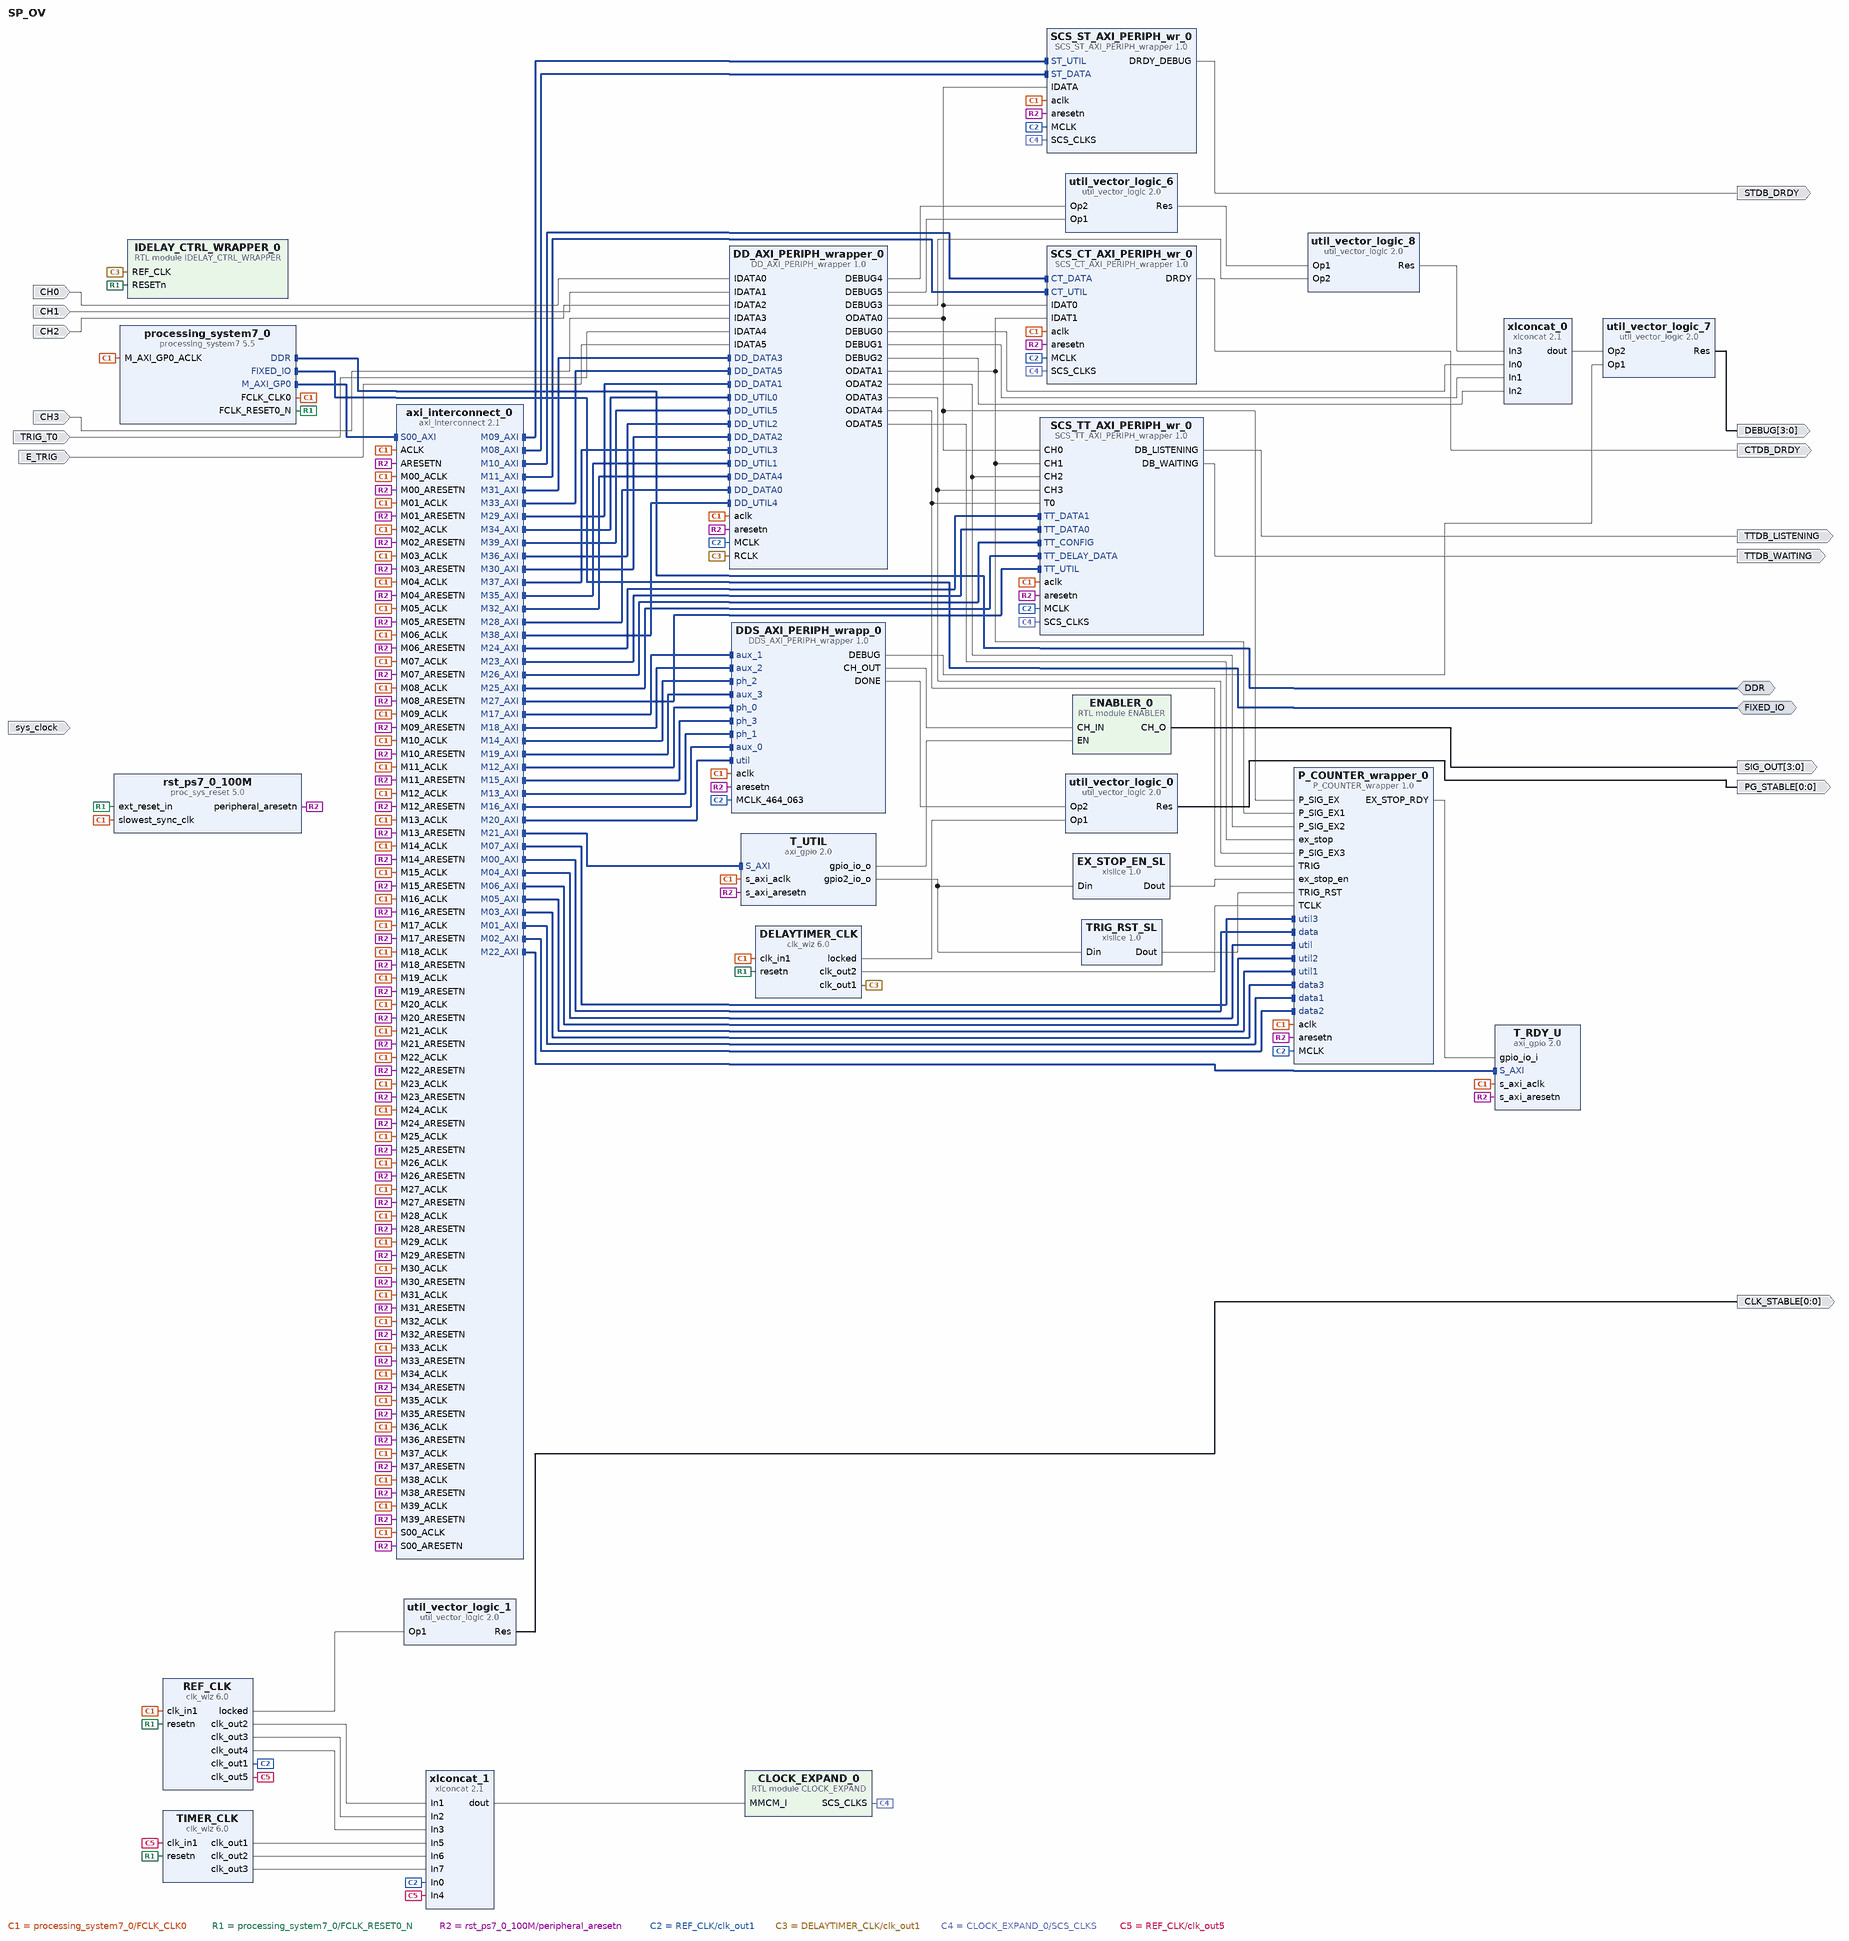
[diagram p0: block diagram of the top level]
# Vivado block design SP_OV, xc7z020clg400-1, Vivado 2019.1
create_bd_design SP_OV

create_bd_intf_port -mode Master -vlnv xilinx.com:interface:ddrx_rtl:1.0 DDR
create_bd_intf_port -mode Master -vlnv xilinx.com:display_processing_system7:fixedio_rtl:1.0 FIXED_IO
create_bd_port -dir I -type clk sys_clock
set_property -dict {CONFIG.FREQ_HZ 125000000 CONFIG.PHASE 0.000} [get_bd_ports sys_clock]
create_bd_port -dir I CH0
create_bd_port -dir I CH1
create_bd_port -dir I CH2
create_bd_port -dir I CH3
create_bd_port -dir O -from 3 -to 0 SIG_OUT
create_bd_port -dir O -from 0 -to 0 PG_STABLE
create_bd_port -dir O -from 0 -to 0 CLK_STABLE
create_bd_port -dir O -from 3 -to 0 DEBUG
create_bd_port -dir I TRIG_T0
create_bd_port -dir I E_TRIG
create_bd_port -dir O STDB_DRDY
create_bd_port -dir O CTDB_DRDY
create_bd_port -dir O TTDB_LISTENING
create_bd_port -dir O TTDB_WAITING

create_bd_cell -type ip -vlnv xilinx.com:ip:processing_system7:5.5 processing_system7_0
set_property -dict [list \
  CONFIG.PCW_APU_PERIPHERAL_FREQMHZ 650 \
  CONFIG.PCW_CRYSTAL_PERIPHERAL_FREQMHZ 50 \
  CONFIG.PCW_ENET0_ENET0_IO {MIO 16 .. 27} \
  CONFIG.PCW_ENET0_GRP_MDIO_ENABLE 1 \
  CONFIG.PCW_ENET0_GRP_MDIO_IO {MIO 52 .. 53} \
  CONFIG.PCW_ENET0_PERIPHERAL_ENABLE 1 \
  CONFIG.PCW_ENET0_RESET_ENABLE 1 \
  CONFIG.PCW_ENET0_RESET_IO {MIO 9} \
  CONFIG.PCW_ENET_RESET_ENABLE 1 \
  CONFIG.PCW_ENET_RESET_SELECT {Share reset pin} \
  CONFIG.PCW_FPGA0_PERIPHERAL_FREQMHZ 100 \
  CONFIG.PCW_FPGA1_PERIPHERAL_FREQMHZ 50 \
  CONFIG.PCW_GPIO_MIO_GPIO_ENABLE 1 \
  CONFIG.PCW_GPIO_MIO_GPIO_IO MIO \
  CONFIG.PCW_I2C_RESET_ENABLE 1 \
  CONFIG.PCW_M_AXI_GP0_FREQMHZ 10 \
  CONFIG.PCW_PERIPHERAL_BOARD_PRESET part0 \
  CONFIG.PCW_PRESET_BANK1_VOLTAGE {LVCMOS 1.8V} \
  CONFIG.PCW_QSPI_GRP_FBCLK_ENABLE 1 \
  CONFIG.PCW_QSPI_GRP_FBCLK_IO {MIO 8} \
  CONFIG.PCW_QSPI_GRP_SINGLE_SS_ENABLE 1 \
  CONFIG.PCW_QSPI_GRP_SINGLE_SS_IO {MIO 1 .. 6} \
  CONFIG.PCW_QSPI_PERIPHERAL_ENABLE 1 \
  CONFIG.PCW_QSPI_QSPI_IO {MIO 1 .. 6} \
  CONFIG.PCW_SD0_GRP_CD_ENABLE 1 \
  CONFIG.PCW_SD0_GRP_CD_IO {MIO 47} \
  CONFIG.PCW_SD0_GRP_WP_ENABLE 0 \
  CONFIG.PCW_SD0_PERIPHERAL_ENABLE 1 \
  CONFIG.PCW_SD0_SD0_IO {MIO 40 .. 45} \
  CONFIG.PCW_SDIO_PERIPHERAL_FREQMHZ 50 \
  CONFIG.PCW_SINGLE_QSPI_DATA_MODE x4 \
  CONFIG.PCW_UART0_PERIPHERAL_ENABLE 1 \
  CONFIG.PCW_UART0_UART0_IO {MIO 14 .. 15} \
  CONFIG.PCW_UART1_PERIPHERAL_ENABLE 0 \
  CONFIG.PCW_UART_PERIPHERAL_FREQMHZ 100 \
  CONFIG.PCW_UIPARAM_DDR_BUS_WIDTH {16 Bit} \
  CONFIG.PCW_UIPARAM_DDR_FREQ_MHZ 525 \
  CONFIG.PCW_UIPARAM_DDR_PARTNO {MT41J256M16 RE-125} \
  CONFIG.PCW_USB0_PERIPHERAL_ENABLE 1 \
  CONFIG.PCW_USB0_RESET_ENABLE 1 \
  CONFIG.PCW_USB0_RESET_IO {MIO 46} \
  CONFIG.PCW_USB0_USB0_IO {MIO 28 .. 39} \
  CONFIG.PCW_USB_RESET_ENABLE 1 \
  CONFIG.PCW_USB_RESET_SELECT {Share reset pin} \
] [get_bd_cells processing_system7_0]
# 486 more settings of processing_system7_0 are not shown: defaults, MIO pin electricals, DDR timing, and values the tool derives
create_bd_cell -type ip -vlnv xilinx.com:ip:axi_interconnect:2.1 axi_interconnect_0
set_property -dict {CONFIG.NUM_MI 40} [get_bd_cells axi_interconnect_0]
create_bd_cell -type ip -vlnv xilinx.com:ip:proc_sys_reset:5.0 rst_ps7_0_100M
create_bd_cell -type ip -vlnv xilinx.com:ip:util_vector_logic:2.0 util_vector_logic_0
set_property -dict {CONFIG.C_SIZE 1} [get_bd_cells util_vector_logic_0]
create_bd_cell -type ip -vlnv xilinx.com:ip:util_vector_logic:2.0 util_vector_logic_1
set_property -dict {CONFIG.C_SIZE 1} [get_bd_cells util_vector_logic_1]
create_bd_cell -type module -reference ENABLER ENABLER_0
create_bd_cell -type ip -vlnv xilinx.com:ip:axi_gpio:2.0 T_UTIL
set_property -dict [list \
  CONFIG.C_ALL_OUTPUTS 1 \
  CONFIG.C_ALL_OUTPUTS_2 1 \
  CONFIG.C_DOUT_DEFAULT 0x0000000F \
  CONFIG.C_GPIO2_WIDTH 2 \
  CONFIG.C_GPIO_WIDTH 4 \
  CONFIG.C_IS_DUAL 1 \
] [get_bd_cells T_UTIL]
create_bd_cell -type ip -vlnv xilinx.com:ip:xlslice:1.0 TRIG_RST_SL
set_property -dict {CONFIG.DIN_FROM 0 CONFIG.DIN_TO 0 CONFIG.DIN_WIDTH 2} [get_bd_cells TRIG_RST_SL]
create_bd_cell -type ip -vlnv xilinx.com:ip:xlslice:1.0 EX_STOP_EN_SL
set_property -dict {CONFIG.DIN_FROM 1 CONFIG.DIN_TO 1 CONFIG.DIN_WIDTH 2} [get_bd_cells EX_STOP_EN_SL]
create_bd_cell -type ip -vlnv xilinx.com:ip:axi_gpio:2.0 T_RDY_U
set_property -dict {CONFIG.C_ALL_INPUTS 1 CONFIG.C_GPIO_WIDTH 1} [get_bd_cells T_RDY_U]
create_bd_cell -type ip -vlnv cri.nz:user:P_COUNTER_wrapper:1.0 P_COUNTER_wrapper_0
create_bd_cell -type ip -vlnv cri.nz:user:DDS_AXI_PERIPH_wrapper:1.0 DDS_AXI_PERIPH_wrapp_0
create_bd_cell -type ip -vlnv cri.nz:user:DD_AXI_PERIPH_wrapper:1.0 DD_AXI_PERIPH_wrapper_0
create_bd_cell -type ip -vlnv xilinx.com:ip:clk_wiz:6.0 DELAYTIMER_CLK
set_property -dict [list \
  CONFIG.CLKOUT1_JITTER 204.659 \
  CONFIG.CLKOUT1_PHASE_ERROR 297.890 \
  CONFIG.CLKOUT1_REQUESTED_OUT_FREQ 310.000 \
  CONFIG.CLKOUT2_JITTER 232.152 \
  CONFIG.CLKOUT2_PHASE_ERROR 297.890 \
  CONFIG.CLKOUT2_REQUESTED_OUT_FREQ 125.000 \
  CONFIG.CLKOUT2_USED true \
  CONFIG.MMCM_CLKFBOUT_MULT_F 50.375 \
  CONFIG.MMCM_CLKOUT0_DIVIDE_F 3.250 \
  CONFIG.MMCM_CLKOUT1_DIVIDE 8 \
  CONFIG.MMCM_DIVCLK_DIVIDE 5 \
  CONFIG.NUM_OUT_CLKS 2 \
  CONFIG.PRIM_IN_FREQ 100.000 \
  CONFIG.RESET_PORT resetn \
  CONFIG.RESET_TYPE ACTIVE_LOW \
  CONFIG.USE_LOCKED true \
] [get_bd_cells DELAYTIMER_CLK]
create_bd_cell -type module -reference IDELAY_CTRL_WRAPPER IDELAY_CTRL_WRAPPER_0
create_bd_cell -type ip -vlnv xilinx.com:ip:clk_wiz:6.0 REF_CLK
set_property -dict [list \
  CONFIG.CLKOUT1_JITTER 210.749 \
  CONFIG.CLKOUT1_PHASE_ERROR 303.235 \
  CONFIG.CLKOUT1_REQUESTED_OUT_FREQ 460.000 \
  CONFIG.CLKOUT2_JITTER 210.749 \
  CONFIG.CLKOUT2_PHASE_ERROR 303.235 \
  CONFIG.CLKOUT2_REQUESTED_OUT_FREQ 460.000 \
  CONFIG.CLKOUT2_REQUESTED_PHASE 22.5 \
  CONFIG.CLKOUT2_USED true \
  CONFIG.CLKOUT3_JITTER 210.749 \
  CONFIG.CLKOUT3_PHASE_ERROR 303.235 \
  CONFIG.CLKOUT3_REQUESTED_OUT_FREQ 460.000 \
  CONFIG.CLKOUT3_REQUESTED_PHASE 45 \
  CONFIG.CLKOUT3_USED true \
  CONFIG.CLKOUT4_JITTER 210.749 \
  CONFIG.CLKOUT4_PHASE_ERROR 303.235 \
  CONFIG.CLKOUT4_REQUESTED_OUT_FREQ 460.000 \
  CONFIG.CLKOUT4_REQUESTED_PHASE 67.5 \
  CONFIG.CLKOUT4_USED true \
  CONFIG.CLKOUT5_JITTER 210.749 \
  CONFIG.CLKOUT5_PHASE_ERROR 303.235 \
  CONFIG.CLKOUT5_REQUESTED_OUT_FREQ 460 \
  CONFIG.CLKOUT5_REQUESTED_PHASE 90 \
  CONFIG.CLKOUT5_USED true \
  CONFIG.MMCM_CLKFBOUT_MULT_F 46.000 \
  CONFIG.MMCM_CLKOUT0_DIVIDE_F 2.000 \
  CONFIG.MMCM_CLKOUT1_DIVIDE 2 \
  CONFIG.MMCM_CLKOUT1_PHASE 22.500 \
  CONFIG.MMCM_CLKOUT2_DIVIDE 2 \
  CONFIG.MMCM_CLKOUT2_PHASE 45.000 \
  CONFIG.MMCM_CLKOUT3_DIVIDE 2 \
  CONFIG.MMCM_CLKOUT3_PHASE 67.500 \
  CONFIG.MMCM_CLKOUT4_DIVIDE 2 \
  CONFIG.MMCM_CLKOUT4_PHASE 90.000 \
  CONFIG.MMCM_DIVCLK_DIVIDE 5 \
  CONFIG.NUM_OUT_CLKS 5 \
  CONFIG.RESET_PORT resetn \
  CONFIG.RESET_TYPE ACTIVE_LOW \
  CONFIG.USE_LOCKED true \
] [get_bd_cells REF_CLK]
create_bd_cell -type ip -vlnv xilinx.com:ip:clk_wiz:6.0 TIMER_CLK
set_property -dict [list \
  CONFIG.CLKIN1_JITTER_PS 21.74 \
  CONFIG.CLKOUT1_JITTER 81.270 \
  CONFIG.CLKOUT1_PHASE_ERROR 90.087 \
  CONFIG.CLKOUT1_REQUESTED_OUT_FREQ 460.000 \
  CONFIG.CLKOUT1_REQUESTED_PHASE 22.5 \
  CONFIG.CLKOUT2_JITTER 81.270 \
  CONFIG.CLKOUT2_PHASE_ERROR 90.087 \
  CONFIG.CLKOUT2_REQUESTED_OUT_FREQ 460.000 \
  CONFIG.CLKOUT2_REQUESTED_PHASE 45 \
  CONFIG.CLKOUT2_USED true \
  CONFIG.CLKOUT3_JITTER 81.270 \
  CONFIG.CLKOUT3_PHASE_ERROR 90.087 \
  CONFIG.CLKOUT3_REQUESTED_OUT_FREQ 460.000 \
  CONFIG.CLKOUT3_REQUESTED_PHASE 67.5 \
  CONFIG.CLKOUT3_USED true \
  CONFIG.CLKOUT4_JITTER 81.270 \
  CONFIG.CLKOUT4_PHASE_ERROR 90.087 \
  CONFIG.CLKOUT4_REQUESTED_OUT_FREQ 460.000 \
  CONFIG.CLKOUT4_REQUESTED_PHASE 90 \
  CONFIG.CLKOUT4_USED false \
  CONFIG.JITTER_SEL Min_O_Jitter \
  CONFIG.MMCM_BANDWIDTH HIGH \
  CONFIG.MMCM_CLKFBOUT_MULT_F 4.000 \
  CONFIG.MMCM_CLKIN1_PERIOD 2.174 \
  CONFIG.MMCM_CLKIN2_PERIOD 10.0 \
  CONFIG.MMCM_CLKOUT0_DIVIDE_F 2.000 \
  CONFIG.MMCM_CLKOUT0_PHASE 22.500 \
  CONFIG.MMCM_CLKOUT1_DIVIDE 2 \
  CONFIG.MMCM_CLKOUT1_PHASE 45.000 \
  CONFIG.MMCM_CLKOUT2_DIVIDE 2 \
  CONFIG.MMCM_CLKOUT2_PHASE 67.500 \
  CONFIG.MMCM_CLKOUT3_DIVIDE 1 \
  CONFIG.MMCM_CLKOUT3_PHASE 90.000 \
  CONFIG.MMCM_DIVCLK_DIVIDE 2 \
  CONFIG.NUM_OUT_CLKS 3 \
  CONFIG.PRIM_IN_FREQ 460 \
  CONFIG.RESET_PORT resetn \
  CONFIG.RESET_TYPE ACTIVE_LOW \
  CONFIG.USE_LOCKED false \
] [get_bd_cells TIMER_CLK]
create_bd_cell -type ip -vlnv xilinx.com:ip:util_vector_logic:2.0 util_vector_logic_6
set_property -dict {CONFIG.C_SIZE 1} [get_bd_cells util_vector_logic_6]
create_bd_cell -type ip -vlnv xilinx.com:ip:util_vector_logic:2.0 util_vector_logic_7
set_property -dict {CONFIG.C_OPERATION and CONFIG.C_SIZE 4} [get_bd_cells util_vector_logic_7]
create_bd_cell -type ip -vlnv xilinx.com:ip:xlconcat:2.1 xlconcat_0
set_property -dict {CONFIG.NUM_PORTS 4} [get_bd_cells xlconcat_0]
create_bd_cell -type ip -vlnv xilinx.com:ip:util_vector_logic:2.0 util_vector_logic_8
set_property -dict {CONFIG.C_SIZE 1} [get_bd_cells util_vector_logic_8]
create_bd_cell -type module -reference CLOCK_EXPAND CLOCK_EXPAND_0
create_bd_cell -type ip -vlnv xilinx.com:ip:xlconcat:2.1 xlconcat_1
set_property -dict {CONFIG.NUM_PORTS 8} [get_bd_cells xlconcat_1]
create_bd_cell -type ip -vlnv cri.nz:user:SCS_CT_AXI_PERIPH_wrapper:1.0 SCS_CT_AXI_PERIPH_wr_0
create_bd_cell -type ip -vlnv cri.nz:user:SCS_ST_AXI_PERIPH_wrapper:1.0 SCS_ST_AXI_PERIPH_wr_0
create_bd_cell -type ip -vlnv cri.nz:user:SCS_TT_AXI_PERIPH_wrapper:1.0 SCS_TT_AXI_PERIPH_wr_0

# ---- connections ----

connect_bd_intf_net [get_bd_intf_pins DD_AXI_PERIPH_wrapper_0/DD_DATA3] [get_bd_intf_pins axi_interconnect_0/M31_AXI]
connect_bd_intf_net [get_bd_intf_pins DD_AXI_PERIPH_wrapper_0/DD_DATA5] [get_bd_intf_pins axi_interconnect_0/M33_AXI]
connect_bd_intf_net [get_bd_intf_pins axi_interconnect_0/M10_AXI] [get_bd_intf_pins SCS_CT_AXI_PERIPH_wr_0/CT_DATA]
connect_bd_intf_net [get_bd_intf_pins axi_interconnect_0/M11_AXI] [get_bd_intf_pins SCS_CT_AXI_PERIPH_wr_0/CT_UTIL]
connect_bd_intf_net [get_bd_intf_pins axi_interconnect_0/M09_AXI] [get_bd_intf_pins SCS_ST_AXI_PERIPH_wr_0/ST_UTIL]
connect_bd_intf_net [get_bd_intf_pins axi_interconnect_0/M08_AXI] [get_bd_intf_pins SCS_ST_AXI_PERIPH_wr_0/ST_DATA]
connect_bd_intf_net [get_bd_intf_pins DD_AXI_PERIPH_wrapper_0/DD_DATA1] [get_bd_intf_pins axi_interconnect_0/M29_AXI]
connect_bd_intf_net [get_bd_intf_pins DD_AXI_PERIPH_wrapper_0/DD_UTIL0] [get_bd_intf_pins axi_interconnect_0/M34_AXI]
connect_bd_intf_net [get_bd_intf_pins axi_interconnect_0/M22_AXI] [get_bd_intf_pins T_RDY_U/S_AXI]
connect_bd_intf_net [get_bd_intf_pins P_COUNTER_wrapper_0/util3] [get_bd_intf_pins axi_interconnect_0/M07_AXI]
connect_bd_intf_net [get_bd_intf_pins P_COUNTER_wrapper_0/data] [get_bd_intf_pins axi_interconnect_0/M00_AXI]
connect_bd_intf_net [get_bd_intf_pins P_COUNTER_wrapper_0/util] [get_bd_intf_pins axi_interconnect_0/M04_AXI]
connect_bd_intf_net [get_bd_intf_ports DDR] [get_bd_intf_pins processing_system7_0/DDR]
connect_bd_intf_net [get_bd_intf_pins axi_interconnect_0/M17_AXI] [get_bd_intf_pins DDS_AXI_PERIPH_wrapp_0/aux_1]
connect_bd_intf_net [get_bd_intf_ports FIXED_IO] [get_bd_intf_pins processing_system7_0/FIXED_IO]
connect_bd_intf_net [get_bd_intf_pins P_COUNTER_wrapper_0/util2] [get_bd_intf_pins axi_interconnect_0/M06_AXI]
connect_bd_intf_net [get_bd_intf_pins axi_interconnect_0/M18_AXI] [get_bd_intf_pins DDS_AXI_PERIPH_wrapp_0/aux_2]
connect_bd_intf_net [get_bd_intf_pins P_COUNTER_wrapper_0/util1] [get_bd_intf_pins axi_interconnect_0/M05_AXI]
connect_bd_intf_net [get_bd_intf_pins processing_system7_0/M_AXI_GP0] [get_bd_intf_pins axi_interconnect_0/S00_AXI]
connect_bd_intf_net [get_bd_intf_pins axi_interconnect_0/M14_AXI] [get_bd_intf_pins DDS_AXI_PERIPH_wrapp_0/ph_2]
connect_bd_intf_net [get_bd_intf_pins axi_interconnect_0/M19_AXI] [get_bd_intf_pins DDS_AXI_PERIPH_wrapp_0/aux_3]
connect_bd_intf_net [get_bd_intf_pins axi_interconnect_0/M12_AXI] [get_bd_intf_pins DDS_AXI_PERIPH_wrapp_0/ph_0]
connect_bd_intf_net [get_bd_intf_pins P_COUNTER_wrapper_0/data3] [get_bd_intf_pins axi_interconnect_0/M03_AXI]
connect_bd_intf_net [get_bd_intf_pins axi_interconnect_0/M15_AXI] [get_bd_intf_pins DDS_AXI_PERIPH_wrapp_0/ph_3]
connect_bd_intf_net [get_bd_intf_pins P_COUNTER_wrapper_0/data1] [get_bd_intf_pins axi_interconnect_0/M01_AXI]
connect_bd_intf_net [get_bd_intf_pins axi_interconnect_0/M21_AXI] [get_bd_intf_pins T_UTIL/S_AXI]
connect_bd_intf_net [get_bd_intf_pins axi_interconnect_0/M13_AXI] [get_bd_intf_pins DDS_AXI_PERIPH_wrapp_0/ph_1]
connect_bd_intf_net [get_bd_intf_pins axi_interconnect_0/M16_AXI] [get_bd_intf_pins DDS_AXI_PERIPH_wrapp_0/aux_0]
connect_bd_intf_net [get_bd_intf_pins P_COUNTER_wrapper_0/data2] [get_bd_intf_pins axi_interconnect_0/M02_AXI]
connect_bd_intf_net [get_bd_intf_pins axi_interconnect_0/M20_AXI] [get_bd_intf_pins DDS_AXI_PERIPH_wrapp_0/util]
connect_bd_intf_net [get_bd_intf_pins SCS_TT_AXI_PERIPH_wr_0/TT_DATA1] [get_bd_intf_pins axi_interconnect_0/M24_AXI]
connect_bd_intf_net [get_bd_intf_pins SCS_TT_AXI_PERIPH_wr_0/TT_DATA0] [get_bd_intf_pins axi_interconnect_0/M23_AXI]
connect_bd_intf_net [get_bd_intf_pins DD_AXI_PERIPH_wrapper_0/DD_UTIL5] [get_bd_intf_pins axi_interconnect_0/M39_AXI]
connect_bd_intf_net [get_bd_intf_pins DD_AXI_PERIPH_wrapper_0/DD_UTIL2] [get_bd_intf_pins axi_interconnect_0/M36_AXI]
connect_bd_intf_net [get_bd_intf_pins DD_AXI_PERIPH_wrapper_0/DD_DATA2] [get_bd_intf_pins axi_interconnect_0/M30_AXI]
connect_bd_intf_net [get_bd_intf_pins DD_AXI_PERIPH_wrapper_0/DD_UTIL3] [get_bd_intf_pins axi_interconnect_0/M37_AXI]
connect_bd_intf_net [get_bd_intf_pins DD_AXI_PERIPH_wrapper_0/DD_UTIL1] [get_bd_intf_pins axi_interconnect_0/M35_AXI]
connect_bd_intf_net [get_bd_intf_pins SCS_TT_AXI_PERIPH_wr_0/TT_CONFIG] [get_bd_intf_pins axi_interconnect_0/M26_AXI]
connect_bd_intf_net [get_bd_intf_pins SCS_TT_AXI_PERIPH_wr_0/TT_DELAY_DATA] [get_bd_intf_pins axi_interconnect_0/M25_AXI]
connect_bd_intf_net [get_bd_intf_pins SCS_TT_AXI_PERIPH_wr_0/TT_UTIL] [get_bd_intf_pins axi_interconnect_0/M27_AXI]
connect_bd_intf_net [get_bd_intf_pins DD_AXI_PERIPH_wrapper_0/DD_DATA4] [get_bd_intf_pins axi_interconnect_0/M32_AXI]
connect_bd_intf_net [get_bd_intf_pins DD_AXI_PERIPH_wrapper_0/DD_DATA0] [get_bd_intf_pins axi_interconnect_0/M28_AXI]
connect_bd_intf_net [get_bd_intf_pins DD_AXI_PERIPH_wrapper_0/DD_UTIL4] [get_bd_intf_pins axi_interconnect_0/M38_AXI]
connect_bd_net [get_bd_pins processing_system7_0/FCLK_CLK0] \
  [get_bd_pins axi_interconnect_0/ACLK] [get_bd_pins rst_ps7_0_100M/slowest_sync_clk] \
  [get_bd_pins processing_system7_0/M_AXI_GP0_ACLK] [get_bd_pins axi_interconnect_0/S00_ACLK] \
  [get_bd_pins axi_interconnect_0/M00_ACLK] [get_bd_pins axi_interconnect_0/M01_ACLK] \
  [get_bd_pins axi_interconnect_0/M02_ACLK] [get_bd_pins axi_interconnect_0/M03_ACLK] \
  [get_bd_pins axi_interconnect_0/M04_ACLK] [get_bd_pins axi_interconnect_0/M05_ACLK] \
  [get_bd_pins axi_interconnect_0/M06_ACLK] [get_bd_pins axi_interconnect_0/M07_ACLK] \
  [get_bd_pins axi_interconnect_0/M12_ACLK] [get_bd_pins axi_interconnect_0/M13_ACLK] \
  [get_bd_pins axi_interconnect_0/M14_ACLK] [get_bd_pins axi_interconnect_0/M15_ACLK] \
  [get_bd_pins axi_interconnect_0/M16_ACLK] [get_bd_pins axi_interconnect_0/M17_ACLK] \
  [get_bd_pins axi_interconnect_0/M18_ACLK] [get_bd_pins axi_interconnect_0/M08_ACLK] \
  [get_bd_pins axi_interconnect_0/M09_ACLK] [get_bd_pins axi_interconnect_0/M10_ACLK] \
  [get_bd_pins axi_interconnect_0/M11_ACLK] [get_bd_pins axi_interconnect_0/M19_ACLK] \
  [get_bd_pins axi_interconnect_0/M20_ACLK] [get_bd_pins T_UTIL/s_axi_aclk] [get_bd_pins axi_interconnect_0/M21_ACLK] \
  [get_bd_pins T_RDY_U/s_axi_aclk] [get_bd_pins axi_interconnect_0/M22_ACLK] [get_bd_pins P_COUNTER_wrapper_0/aclk] \
  [get_bd_pins DDS_AXI_PERIPH_wrapp_0/aclk] [get_bd_pins axi_interconnect_0/M23_ACLK] \
  [get_bd_pins axi_interconnect_0/M24_ACLK] [get_bd_pins axi_interconnect_0/M25_ACLK] \
  [get_bd_pins axi_interconnect_0/M26_ACLK] [get_bd_pins axi_interconnect_0/M27_ACLK] \
  [get_bd_pins axi_interconnect_0/M28_ACLK] [get_bd_pins DD_AXI_PERIPH_wrapper_0/aclk] [get_bd_pins DELAYTIMER_CLK/clk_in1] \
  [get_bd_pins axi_interconnect_0/M29_ACLK] [get_bd_pins axi_interconnect_0/M30_ACLK] \
  [get_bd_pins axi_interconnect_0/M31_ACLK] [get_bd_pins axi_interconnect_0/M32_ACLK] \
  [get_bd_pins axi_interconnect_0/M33_ACLK] [get_bd_pins axi_interconnect_0/M34_ACLK] \
  [get_bd_pins axi_interconnect_0/M35_ACLK] [get_bd_pins axi_interconnect_0/M36_ACLK] \
  [get_bd_pins axi_interconnect_0/M37_ACLK] [get_bd_pins axi_interconnect_0/M38_ACLK] \
  [get_bd_pins axi_interconnect_0/M39_ACLK] [get_bd_pins REF_CLK/clk_in1] [get_bd_pins SCS_CT_AXI_PERIPH_wr_0/aclk] \
  [get_bd_pins SCS_ST_AXI_PERIPH_wr_0/aclk] [get_bd_pins SCS_TT_AXI_PERIPH_wr_0/aclk]
connect_bd_net [get_bd_pins processing_system7_0/FCLK_RESET0_N] \
  [get_bd_pins rst_ps7_0_100M/ext_reset_in] [get_bd_pins DELAYTIMER_CLK/resetn] [get_bd_pins IDELAY_CTRL_WRAPPER_0/RESETn] \
  [get_bd_pins REF_CLK/resetn] [get_bd_pins TIMER_CLK/resetn]
connect_bd_net [get_bd_pins rst_ps7_0_100M/peripheral_aresetn] \
  [get_bd_pins axi_interconnect_0/ARESETN] [get_bd_pins axi_interconnect_0/S00_ARESETN] \
  [get_bd_pins axi_interconnect_0/M00_ARESETN] [get_bd_pins axi_interconnect_0/M01_ARESETN] \
  [get_bd_pins axi_interconnect_0/M02_ARESETN] [get_bd_pins axi_interconnect_0/M03_ARESETN] \
  [get_bd_pins axi_interconnect_0/M04_ARESETN] [get_bd_pins axi_interconnect_0/M05_ARESETN] \
  [get_bd_pins axi_interconnect_0/M06_ARESETN] [get_bd_pins axi_interconnect_0/M07_ARESETN] \
  [get_bd_pins axi_interconnect_0/M12_ARESETN] [get_bd_pins axi_interconnect_0/M13_ARESETN] \
  [get_bd_pins axi_interconnect_0/M14_ARESETN] [get_bd_pins axi_interconnect_0/M15_ARESETN] \
  [get_bd_pins axi_interconnect_0/M16_ARESETN] [get_bd_pins axi_interconnect_0/M17_ARESETN] \
  [get_bd_pins axi_interconnect_0/M18_ARESETN] [get_bd_pins axi_interconnect_0/M08_ARESETN] \
  [get_bd_pins axi_interconnect_0/M09_ARESETN] [get_bd_pins axi_interconnect_0/M10_ARESETN] \
  [get_bd_pins axi_interconnect_0/M11_ARESETN] [get_bd_pins axi_interconnect_0/M19_ARESETN] \
  [get_bd_pins axi_interconnect_0/M20_ARESETN] [get_bd_pins T_UTIL/s_axi_aresetn] \
  [get_bd_pins axi_interconnect_0/M21_ARESETN] [get_bd_pins T_RDY_U/s_axi_aresetn] \
  [get_bd_pins axi_interconnect_0/M22_ARESETN] [get_bd_pins P_COUNTER_wrapper_0/aresetn] \
  [get_bd_pins DDS_AXI_PERIPH_wrapp_0/aresetn] [get_bd_pins axi_interconnect_0/M23_ARESETN] \
  [get_bd_pins axi_interconnect_0/M24_ARESETN] [get_bd_pins axi_interconnect_0/M25_ARESETN] \
  [get_bd_pins axi_interconnect_0/M26_ARESETN] [get_bd_pins axi_interconnect_0/M27_ARESETN] \
  [get_bd_pins axi_interconnect_0/M28_ARESETN] [get_bd_pins DD_AXI_PERIPH_wrapper_0/aresetn] \
  [get_bd_pins axi_interconnect_0/M29_ARESETN] [get_bd_pins axi_interconnect_0/M30_ARESETN] \
  [get_bd_pins axi_interconnect_0/M31_ARESETN] [get_bd_pins axi_interconnect_0/M32_ARESETN] \
  [get_bd_pins axi_interconnect_0/M33_ARESETN] [get_bd_pins axi_interconnect_0/M34_ARESETN] \
  [get_bd_pins axi_interconnect_0/M35_ARESETN] [get_bd_pins axi_interconnect_0/M36_ARESETN] \
  [get_bd_pins axi_interconnect_0/M37_ARESETN] [get_bd_pins axi_interconnect_0/M38_ARESETN] \
  [get_bd_pins axi_interconnect_0/M39_ARESETN] [get_bd_pins SCS_CT_AXI_PERIPH_wr_0/aresetn] \
  [get_bd_pins SCS_ST_AXI_PERIPH_wr_0/aresetn] [get_bd_pins SCS_TT_AXI_PERIPH_wr_0/aresetn]
connect_bd_net [get_bd_pins REF_CLK/clk_out1] \
  [get_bd_pins P_COUNTER_wrapper_0/MCLK] [get_bd_pins DDS_AXI_PERIPH_wrapp_0/MCLK_464_063] \
  [get_bd_pins DD_AXI_PERIPH_wrapper_0/MCLK] [get_bd_pins xlconcat_1/In0] [get_bd_pins SCS_CT_AXI_PERIPH_wr_0/MCLK] \
  [get_bd_pins SCS_ST_AXI_PERIPH_wr_0/MCLK] [get_bd_pins SCS_TT_AXI_PERIPH_wr_0/MCLK]
connect_bd_net [get_bd_pins util_vector_logic_0/Res] [get_bd_ports PG_STABLE]
connect_bd_net [get_bd_pins DDS_AXI_PERIPH_wrapp_0/DONE] [get_bd_pins util_vector_logic_0/Op2]
connect_bd_net [get_bd_pins util_vector_logic_1/Res] [get_bd_ports CLK_STABLE]
connect_bd_net [get_bd_pins DDS_AXI_PERIPH_wrapp_0/CH_OUT] [get_bd_pins ENABLER_0/CH_IN]
connect_bd_net [get_bd_pins ENABLER_0/CH_O] [get_bd_ports SIG_OUT]
connect_bd_net -net axi_gpio_0_gpio_io_o [get_bd_pins T_UTIL/gpio_io_o] [get_bd_pins ENABLER_0/EN]
connect_bd_net [get_bd_pins T_UTIL/gpio2_io_o] [get_bd_pins TRIG_RST_SL/Din] [get_bd_pins EX_STOP_EN_SL/Din]
connect_bd_net [get_bd_pins TRIG_RST_SL/Dout] [get_bd_pins P_COUNTER_wrapper_0/TRIG_RST]
connect_bd_net [get_bd_pins EX_STOP_EN_SL/Dout] [get_bd_pins P_COUNTER_wrapper_0/ex_stop_en]
connect_bd_net [get_bd_pins P_COUNTER_wrapper_0/EX_STOP_RDY] [get_bd_pins T_RDY_U/gpio_io_i]
connect_bd_net -net CH0_1 [get_bd_pins DD_AXI_PERIPH_wrapper_0/ODATA0] \
  [get_bd_pins P_COUNTER_wrapper_0/P_SIG_EX] [get_bd_pins SCS_CT_AXI_PERIPH_wr_0/IDAT0] \
  [get_bd_pins SCS_ST_AXI_PERIPH_wr_0/IDATA] [get_bd_pins SCS_TT_AXI_PERIPH_wr_0/CH0]
connect_bd_net -net CH1_2 [get_bd_pins DD_AXI_PERIPH_wrapper_0/ODATA1] \
  [get_bd_pins P_COUNTER_wrapper_0/P_SIG_EX1] [get_bd_pins SCS_CT_AXI_PERIPH_wr_0/IDAT1] \
  [get_bd_pins SCS_TT_AXI_PERIPH_wr_0/CH1]
connect_bd_net -net CH2_2 [get_bd_pins DD_AXI_PERIPH_wrapper_0/ODATA2] \
  [get_bd_pins P_COUNTER_wrapper_0/P_SIG_EX2] [get_bd_pins SCS_TT_AXI_PERIPH_wr_0/CH2]
connect_bd_net -net CH3_2 [get_bd_pins DD_AXI_PERIPH_wrapper_0/ODATA3] \
  [get_bd_pins P_COUNTER_wrapper_0/P_SIG_EX3] [get_bd_pins SCS_TT_AXI_PERIPH_wr_0/CH3]
connect_bd_net -net TRIG_T0_2 [get_bd_pins DD_AXI_PERIPH_wrapper_0/ODATA4] \
  [get_bd_pins P_COUNTER_wrapper_0/TRIG] [get_bd_pins SCS_TT_AXI_PERIPH_wr_0/T0]
connect_bd_net -net clk_wiz_0_clk_out1 [get_bd_pins DELAYTIMER_CLK/clk_out1] \
  [get_bd_pins DD_AXI_PERIPH_wrapper_0/RCLK] [get_bd_pins IDELAY_CTRL_WRAPPER_0/REF_CLK]
connect_bd_net [get_bd_pins REF_CLK/locked] [get_bd_pins util_vector_logic_1/Op1]
connect_bd_net [get_bd_pins DD_AXI_PERIPH_wrapper_0/DEBUG4] [get_bd_pins util_vector_logic_6/Op2]
connect_bd_net [get_bd_pins DD_AXI_PERIPH_wrapper_0/DEBUG5] [get_bd_pins util_vector_logic_6/Op1]
connect_bd_net [get_bd_pins util_vector_logic_7/Res] [get_bd_ports DEBUG]
connect_bd_net [get_bd_pins DDS_AXI_PERIPH_wrapp_0/DEBUG] [get_bd_pins util_vector_logic_7/Op1]
connect_bd_net [get_bd_pins DD_AXI_PERIPH_wrapper_0/DEBUG0] [get_bd_pins xlconcat_0/In0]
connect_bd_net [get_bd_pins DD_AXI_PERIPH_wrapper_0/DEBUG1] [get_bd_pins xlconcat_0/In1]
connect_bd_net [get_bd_pins DD_AXI_PERIPH_wrapper_0/DEBUG2] [get_bd_pins xlconcat_0/In2]
connect_bd_net [get_bd_pins xlconcat_0/dout] [get_bd_pins util_vector_logic_7/Op2]
connect_bd_net [get_bd_pins util_vector_logic_6/Res] [get_bd_pins util_vector_logic_8/Op1]
connect_bd_net [get_bd_pins DD_AXI_PERIPH_wrapper_0/DEBUG3] [get_bd_pins util_vector_logic_8/Op2]
connect_bd_net [get_bd_pins util_vector_logic_8/Res] [get_bd_pins xlconcat_0/In3]
connect_bd_net [get_bd_pins REF_CLK/clk_out2] [get_bd_pins xlconcat_1/In1]
connect_bd_net [get_bd_pins REF_CLK/clk_out3] [get_bd_pins xlconcat_1/In2]
connect_bd_net [get_bd_pins REF_CLK/clk_out4] [get_bd_pins xlconcat_1/In3]
connect_bd_net [get_bd_pins xlconcat_1/dout] [get_bd_pins CLOCK_EXPAND_0/MMCM_I]
connect_bd_net [get_bd_pins CLOCK_EXPAND_0/SCS_CLKS] \
  [get_bd_pins SCS_CT_AXI_PERIPH_wr_0/SCS_CLKS] [get_bd_pins SCS_ST_AXI_PERIPH_wr_0/SCS_CLKS] \
  [get_bd_pins SCS_TT_AXI_PERIPH_wr_0/SCS_CLKS]
connect_bd_net [get_bd_pins SCS_ST_AXI_PERIPH_wr_0/DRDY_DEBUG] [get_bd_ports STDB_DRDY]
connect_bd_net [get_bd_pins SCS_CT_AXI_PERIPH_wr_0/DRDY] [get_bd_ports CTDB_DRDY]
connect_bd_net [get_bd_pins SCS_TT_AXI_PERIPH_wr_0/DB_LISTENING] [get_bd_ports TTDB_LISTENING]
connect_bd_net [get_bd_pins SCS_TT_AXI_PERIPH_wr_0/DB_WAITING] [get_bd_ports TTDB_WAITING]
connect_bd_net -net CH0_2 [get_bd_ports CH0] [get_bd_pins DD_AXI_PERIPH_wrapper_0/IDATA0]
connect_bd_net -net CH1_1 [get_bd_ports CH1] [get_bd_pins DD_AXI_PERIPH_wrapper_0/IDATA1]
connect_bd_net -net CH2_1 [get_bd_ports CH2] [get_bd_pins DD_AXI_PERIPH_wrapper_0/IDATA2]
connect_bd_net -net CH3_1 [get_bd_ports CH3] [get_bd_pins DD_AXI_PERIPH_wrapper_0/IDATA3]
connect_bd_net -net TRIG_T0_1 [get_bd_ports TRIG_T0] [get_bd_pins DD_AXI_PERIPH_wrapper_0/IDATA4]
connect_bd_net [get_bd_ports E_TRIG] [get_bd_pins DD_AXI_PERIPH_wrapper_0/IDATA5]
connect_bd_net [get_bd_pins DD_AXI_PERIPH_wrapper_0/ODATA5] [get_bd_pins P_COUNTER_wrapper_0/ex_stop]
connect_bd_net [get_bd_pins DELAYTIMER_CLK/clk_out2] [get_bd_pins P_COUNTER_wrapper_0/TCLK]
connect_bd_net [get_bd_pins DELAYTIMER_CLK/locked] [get_bd_pins util_vector_logic_0/Op1]
connect_bd_net [get_bd_pins REF_CLK/clk_out5] [get_bd_pins TIMER_CLK/clk_in1] [get_bd_pins xlconcat_1/In4]
connect_bd_net [get_bd_pins TIMER_CLK/clk_out1] [get_bd_pins xlconcat_1/In5]
connect_bd_net [get_bd_pins TIMER_CLK/clk_out2] [get_bd_pins xlconcat_1/In6]
connect_bd_net [get_bd_pins TIMER_CLK/clk_out3] [get_bd_pins xlconcat_1/In7]

# ---- address map ----
assign_bd_address -offset 0x41200000 -range 64K -target_address_space [get_bd_addr_spaces processing_system7_0/Data] [get_bd_addr_segs T_UTIL/S_AXI/Reg]
assign_bd_address -offset 0x41210000 -range 64K -target_address_space [get_bd_addr_spaces processing_system7_0/Data] [get_bd_addr_segs T_RDY_U/S_AXI/Reg]
assign_bd_address -offset 0x43C00000 -range 64K -target_address_space [get_bd_addr_spaces processing_system7_0/Data] [get_bd_addr_segs P_COUNTER_wrapper_0/data/reg0]
assign_bd_address -offset 0x43C10000 -range 64K -target_address_space [get_bd_addr_spaces processing_system7_0/Data] [get_bd_addr_segs P_COUNTER_wrapper_0/data1/reg0]
assign_bd_address -offset 0x43C20000 -range 64K -target_address_space [get_bd_addr_spaces processing_system7_0/Data] [get_bd_addr_segs P_COUNTER_wrapper_0/data2/reg0]
assign_bd_address -offset 0x43C30000 -range 64K -target_address_space [get_bd_addr_spaces processing_system7_0/Data] [get_bd_addr_segs P_COUNTER_wrapper_0/data3/reg0]
assign_bd_address -offset 0x43C40000 -range 64K -target_address_space [get_bd_addr_spaces processing_system7_0/Data] [get_bd_addr_segs P_COUNTER_wrapper_0/util/reg0]
assign_bd_address -offset 0x43C50000 -range 64K -target_address_space [get_bd_addr_spaces processing_system7_0/Data] [get_bd_addr_segs P_COUNTER_wrapper_0/util1/reg0]
assign_bd_address -offset 0x43C60000 -range 64K -target_address_space [get_bd_addr_spaces processing_system7_0/Data] [get_bd_addr_segs P_COUNTER_wrapper_0/util2/reg0]
assign_bd_address -offset 0x43C70000 -range 64K -target_address_space [get_bd_addr_spaces processing_system7_0/Data] [get_bd_addr_segs P_COUNTER_wrapper_0/util3/reg0]
assign_bd_address -offset 0x43C80000 -range 64K -target_address_space [get_bd_addr_spaces processing_system7_0/Data] [get_bd_addr_segs SCS_ST_AXI_PERIPH_wr_0/ST_DATA/reg0]
assign_bd_address -offset 0x43C90000 -range 64K -target_address_space [get_bd_addr_spaces processing_system7_0/Data] [get_bd_addr_segs SCS_ST_AXI_PERIPH_wr_0/ST_UTIL/reg0]
assign_bd_address -offset 0x43CA0000 -range 64K -target_address_space [get_bd_addr_spaces processing_system7_0/Data] [get_bd_addr_segs SCS_CT_AXI_PERIPH_wr_0/CT_DATA/reg0]
assign_bd_address -offset 0x43CB0000 -range 64K -target_address_space [get_bd_addr_spaces processing_system7_0/Data] [get_bd_addr_segs SCS_CT_AXI_PERIPH_wr_0/CT_UTIL/reg0]
assign_bd_address -offset 0x43CC0000 -range 64K -target_address_space [get_bd_addr_spaces processing_system7_0/Data] [get_bd_addr_segs SCS_TT_AXI_PERIPH_wr_0/TT_CONFIG/reg0]
assign_bd_address -offset 0x43CD0000 -range 64K -target_address_space [get_bd_addr_spaces processing_system7_0/Data] [get_bd_addr_segs SCS_TT_AXI_PERIPH_wr_0/TT_DATA0/reg0]
assign_bd_address -offset 0x43CE0000 -range 64K -target_address_space [get_bd_addr_spaces processing_system7_0/Data] [get_bd_addr_segs SCS_TT_AXI_PERIPH_wr_0/TT_DATA1/reg0]
assign_bd_address -offset 0x43CF0000 -range 64K -target_address_space [get_bd_addr_spaces processing_system7_0/Data] [get_bd_addr_segs SCS_TT_AXI_PERIPH_wr_0/TT_DELAY_DATA/reg0]
assign_bd_address -offset 0x43D00000 -range 64K -target_address_space [get_bd_addr_spaces processing_system7_0/Data] [get_bd_addr_segs SCS_TT_AXI_PERIPH_wr_0/TT_UTIL/reg0]
assign_bd_address -offset 0x43D10000 -range 64K -target_address_space [get_bd_addr_spaces processing_system7_0/Data] [get_bd_addr_segs DDS_AXI_PERIPH_wrapp_0/aux_0/reg0]
assign_bd_address -offset 0x43D20000 -range 64K -target_address_space [get_bd_addr_spaces processing_system7_0/Data] [get_bd_addr_segs DDS_AXI_PERIPH_wrapp_0/aux_1/reg0]
assign_bd_address -offset 0x43D30000 -range 64K -target_address_space [get_bd_addr_spaces processing_system7_0/Data] [get_bd_addr_segs DDS_AXI_PERIPH_wrapp_0/aux_2/reg0]
assign_bd_address -offset 0x43D40000 -range 64K -target_address_space [get_bd_addr_spaces processing_system7_0/Data] [get_bd_addr_segs DDS_AXI_PERIPH_wrapp_0/aux_3/reg0]
assign_bd_address -offset 0x43D50000 -range 64K -target_address_space [get_bd_addr_spaces processing_system7_0/Data] [get_bd_addr_segs DDS_AXI_PERIPH_wrapp_0/ph_0/reg0]
assign_bd_address -offset 0x43D60000 -range 64K -target_address_space [get_bd_addr_spaces processing_system7_0/Data] [get_bd_addr_segs DDS_AXI_PERIPH_wrapp_0/ph_1/reg0]
assign_bd_address -offset 0x43D70000 -range 64K -target_address_space [get_bd_addr_spaces processing_system7_0/Data] [get_bd_addr_segs DDS_AXI_PERIPH_wrapp_0/ph_2/reg0]
assign_bd_address -offset 0x43D80000 -range 64K -target_address_space [get_bd_addr_spaces processing_system7_0/Data] [get_bd_addr_segs DDS_AXI_PERIPH_wrapp_0/ph_3/reg0]
assign_bd_address -offset 0x43D90000 -range 64K -target_address_space [get_bd_addr_spaces processing_system7_0/Data] [get_bd_addr_segs DDS_AXI_PERIPH_wrapp_0/util/reg0]
assign_bd_address -offset 0x43DA0000 -range 64K -target_address_space [get_bd_addr_spaces processing_system7_0/Data] [get_bd_addr_segs DD_AXI_PERIPH_wrapper_0/DD_DATA0/reg0]
assign_bd_address -offset 0x43DB0000 -range 64K -target_address_space [get_bd_addr_spaces processing_system7_0/Data] [get_bd_addr_segs DD_AXI_PERIPH_wrapper_0/DD_DATA1/reg0]
assign_bd_address -offset 0x43DC0000 -range 64K -target_address_space [get_bd_addr_spaces processing_system7_0/Data] [get_bd_addr_segs DD_AXI_PERIPH_wrapper_0/DD_DATA2/reg0]
assign_bd_address -offset 0x43DD0000 -range 64K -target_address_space [get_bd_addr_spaces processing_system7_0/Data] [get_bd_addr_segs DD_AXI_PERIPH_wrapper_0/DD_DATA3/reg0]
assign_bd_address -offset 0x43DE0000 -range 64K -target_address_space [get_bd_addr_spaces processing_system7_0/Data] [get_bd_addr_segs DD_AXI_PERIPH_wrapper_0/DD_DATA4/reg0]
assign_bd_address -offset 0x43DF0000 -range 64K -target_address_space [get_bd_addr_spaces processing_system7_0/Data] [get_bd_addr_segs DD_AXI_PERIPH_wrapper_0/DD_DATA5/reg0]
assign_bd_address -offset 0x43E00000 -range 64K -target_address_space [get_bd_addr_spaces processing_system7_0/Data] [get_bd_addr_segs DD_AXI_PERIPH_wrapper_0/DD_UTIL0/reg0]
assign_bd_address -offset 0x43E10000 -range 64K -target_address_space [get_bd_addr_spaces processing_system7_0/Data] [get_bd_addr_segs DD_AXI_PERIPH_wrapper_0/DD_UTIL1/reg0]
assign_bd_address -offset 0x43E20000 -range 64K -target_address_space [get_bd_addr_spaces processing_system7_0/Data] [get_bd_addr_segs DD_AXI_PERIPH_wrapper_0/DD_UTIL2/reg0]
assign_bd_address -offset 0x43E30000 -range 64K -target_address_space [get_bd_addr_spaces processing_system7_0/Data] [get_bd_addr_segs DD_AXI_PERIPH_wrapper_0/DD_UTIL3/reg0]
assign_bd_address -offset 0x43E40000 -range 64K -target_address_space [get_bd_addr_spaces processing_system7_0/Data] [get_bd_addr_segs DD_AXI_PERIPH_wrapper_0/DD_UTIL4/reg0]
assign_bd_address -offset 0x43E50000 -range 64K -target_address_space [get_bd_addr_spaces processing_system7_0/Data] [get_bd_addr_segs DD_AXI_PERIPH_wrapper_0/DD_UTIL5/reg0]

validate_bd_design
save_bd_design
